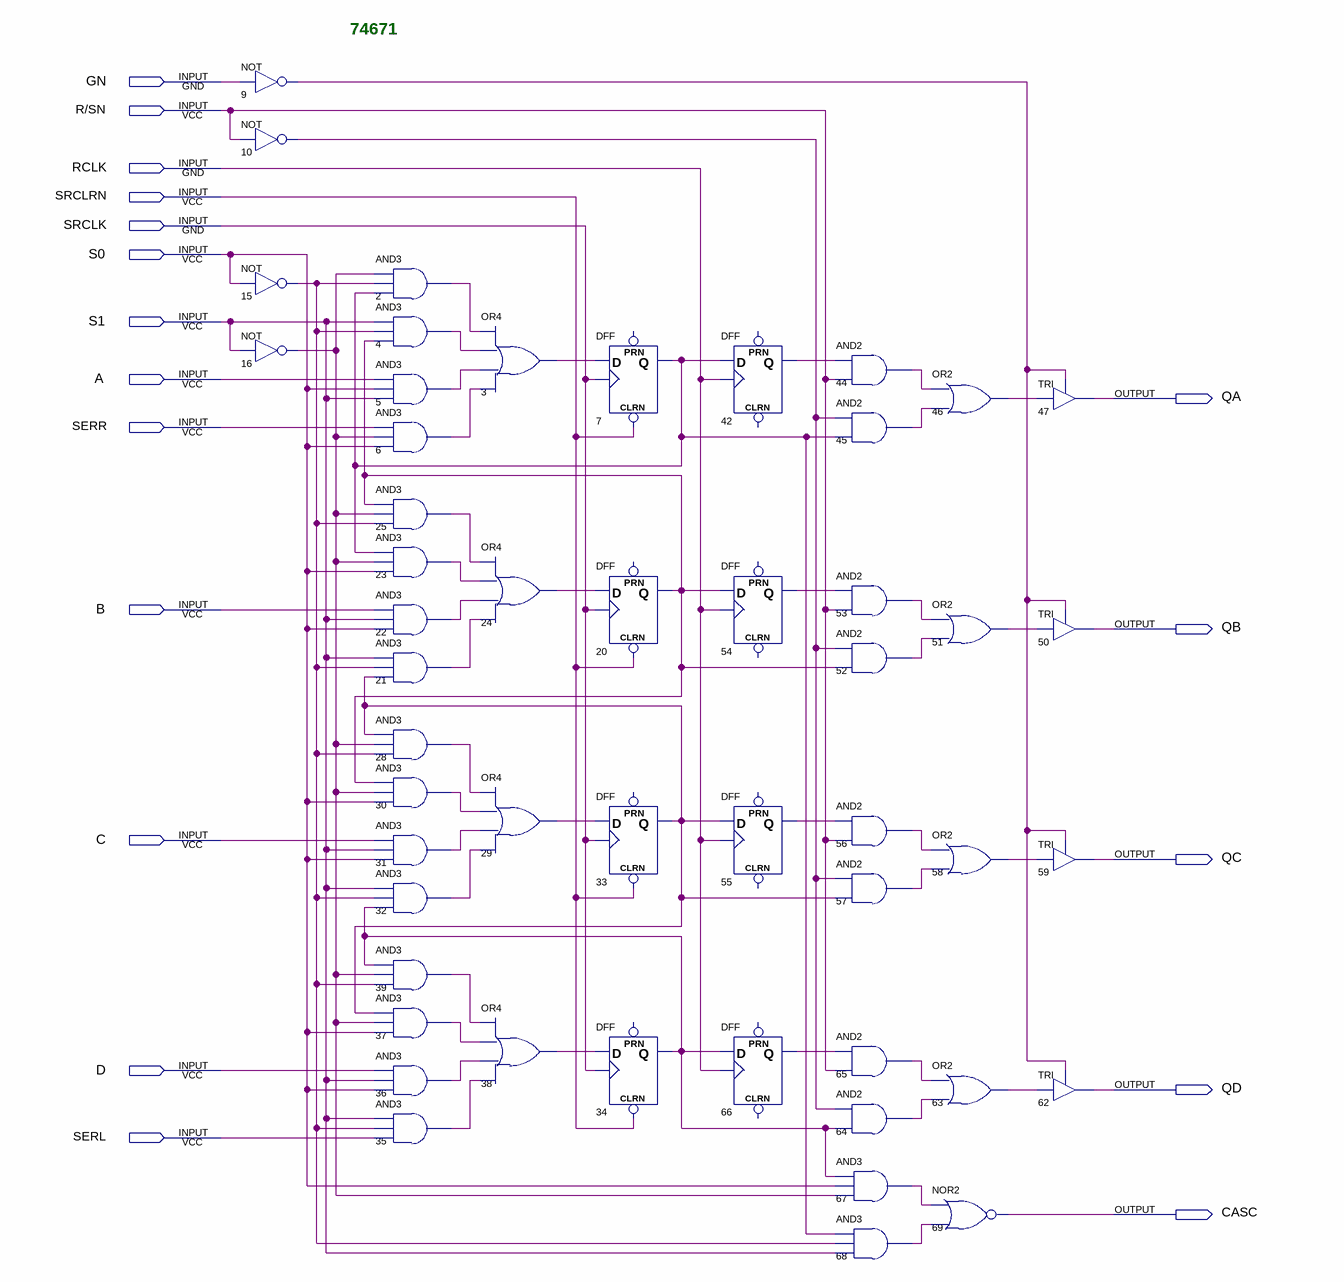
[diagram p0: schematic sheet]
// Quartus schematic 74671.bdf as structural Verilog: 51 symbols, 18 pins
module \74671  (
  input  GN,
  input  \R/SN ,
  input  RCLK,
  input  SRCLRN,
  input  SRCLK,
  input  S0,
  input  S1,
  input  A,
  input  SERR,
  input  B,
  input  C,
  input  D,
  input  SERL,
  output QA,
  output QB,
  output QC,
  output QD,
  output CASC
);

  wire n2_out, n3_out, n4_out, n5_out, n6_out, n7_q, n9_out, n10_out, n15_out, n16_out, n20_q, n21_out,
       n22_out, n23_out, n24_out, n25_out, n28_out, n29_out, n30_out, n31_out, n32_out, n33_q, n34_q,
       n35_out, n36_out, n37_out, n38_out, n39_out, n42_q, n44_out, n45_out, n46_out, n51_out, n52_out,
       n53_out, n54_q, n55_q, n56_out, n57_out, n58_out, n63_out, n64_out, n65_out, n66_q, n67_out, n68_out;

  not u_9 (n9_out, GN);
  not u_10 (n10_out, \R/SN );
  not u_15 (n15_out, S0);
  not u_16 (n16_out, S1);
  and u_2 (n2_out, n16_out, n15_out, n7_q);
  and u_4 (n4_out, S1, n15_out, n20_q);
  and u_5 (n5_out, A, S0, S1);
  and u_6 (n6_out, SERR, n16_out, S0);
  and u_25 (n25_out, n20_q, n16_out, n15_out);
  and u_23 (n23_out, n7_q, n16_out, S0);
  and u_22 (n22_out, B, S1, S0);
  and u_21 (n21_out, S1, n15_out, n33_q);
  and u_28 (n28_out, n33_q, n16_out, n15_out);
  and u_30 (n30_out, n20_q, n16_out, S0);
  and u_31 (n31_out, C, S1, S0);
  and u_32 (n32_out, S1, n15_out, n34_q);
  and u_39 (n39_out, n34_q, n16_out, n15_out);
  and u_37 (n37_out, n33_q, n16_out, S0);
  and u_36 (n36_out, D, S1, S0);
  and u_35 (n35_out, S1, n15_out, SERL);
  or u_3 (n3_out, n2_out, n4_out, n5_out, n6_out);
  or u_24 (n24_out, n25_out, n23_out, n22_out, n21_out);
  or u_29 (n29_out, n28_out, n30_out, n31_out, n32_out);
  or u_38 (n38_out, n39_out, n37_out, n36_out, n35_out);
  DFF u_7 (.CLRN(SRCLRN), .CLK(SRCLK), .D(n3_out), .Q(n7_q));  // open: PRN
  DFF u_20 (.CLRN(SRCLRN), .CLK(SRCLK), .D(n24_out), .Q(n20_q));  // open: PRN
  DFF u_33 (.CLRN(SRCLRN), .CLK(SRCLK), .D(n29_out), .Q(n33_q));  // open: PRN
  DFF u_34 (.CLRN(SRCLRN), .CLK(SRCLK), .D(n38_out), .Q(n34_q));  // open: PRN
  DFF u_42 (.CLK(RCLK), .D(n7_q), .Q(n42_q));  // open: CLRN, PRN
  DFF u_54 (.CLK(RCLK), .D(n20_q), .Q(n54_q));  // open: CLRN, PRN
  DFF u_55 (.CLK(RCLK), .D(n33_q), .Q(n55_q));  // open: CLRN, PRN
  DFF u_66 (.CLK(RCLK), .D(n34_q), .Q(n66_q));  // open: CLRN, PRN
  and u_44 (n44_out, n42_q, \R/SN );
  and u_45 (n45_out, n10_out, n7_q);
  and u_53 (n53_out, n54_q, \R/SN );
  and u_52 (n52_out, n10_out, n20_q);
  and u_56 (n56_out, n55_q, \R/SN );
  and u_57 (n57_out, n10_out, n33_q);
  and u_65 (n65_out, n66_q, \R/SN );
  and u_64 (n64_out, n10_out, n34_q);
  and u_67 (n67_out, n34_q, S0, n16_out);
  and u_68 (n68_out, n7_q, n15_out, S1);
  or u_46 (n46_out, n44_out, n45_out);
  or u_51 (n51_out, n53_out, n52_out);
  or u_58 (n58_out, n56_out, n57_out);
  or u_63 (n63_out, n65_out, n64_out);
  nor u_69 (CASC, n67_out, n68_out);
  TRI u_47 (.IN(n46_out), .OE(n9_out), .OUT(QA));
  TRI u_50 (.IN(n51_out), .OE(n9_out), .OUT(QB));
  TRI u_59 (.IN(n58_out), .OE(n9_out), .OUT(QC));
  TRI u_62 (.IN(n63_out), .OE(n9_out), .OUT(QD));

  // Notes on the sheet:
  //   74671
endmodule
